# Altium schematic sheet Amplifiers1.SchDoc
size A4; SheetNumber: 5; SheetTotal: 7
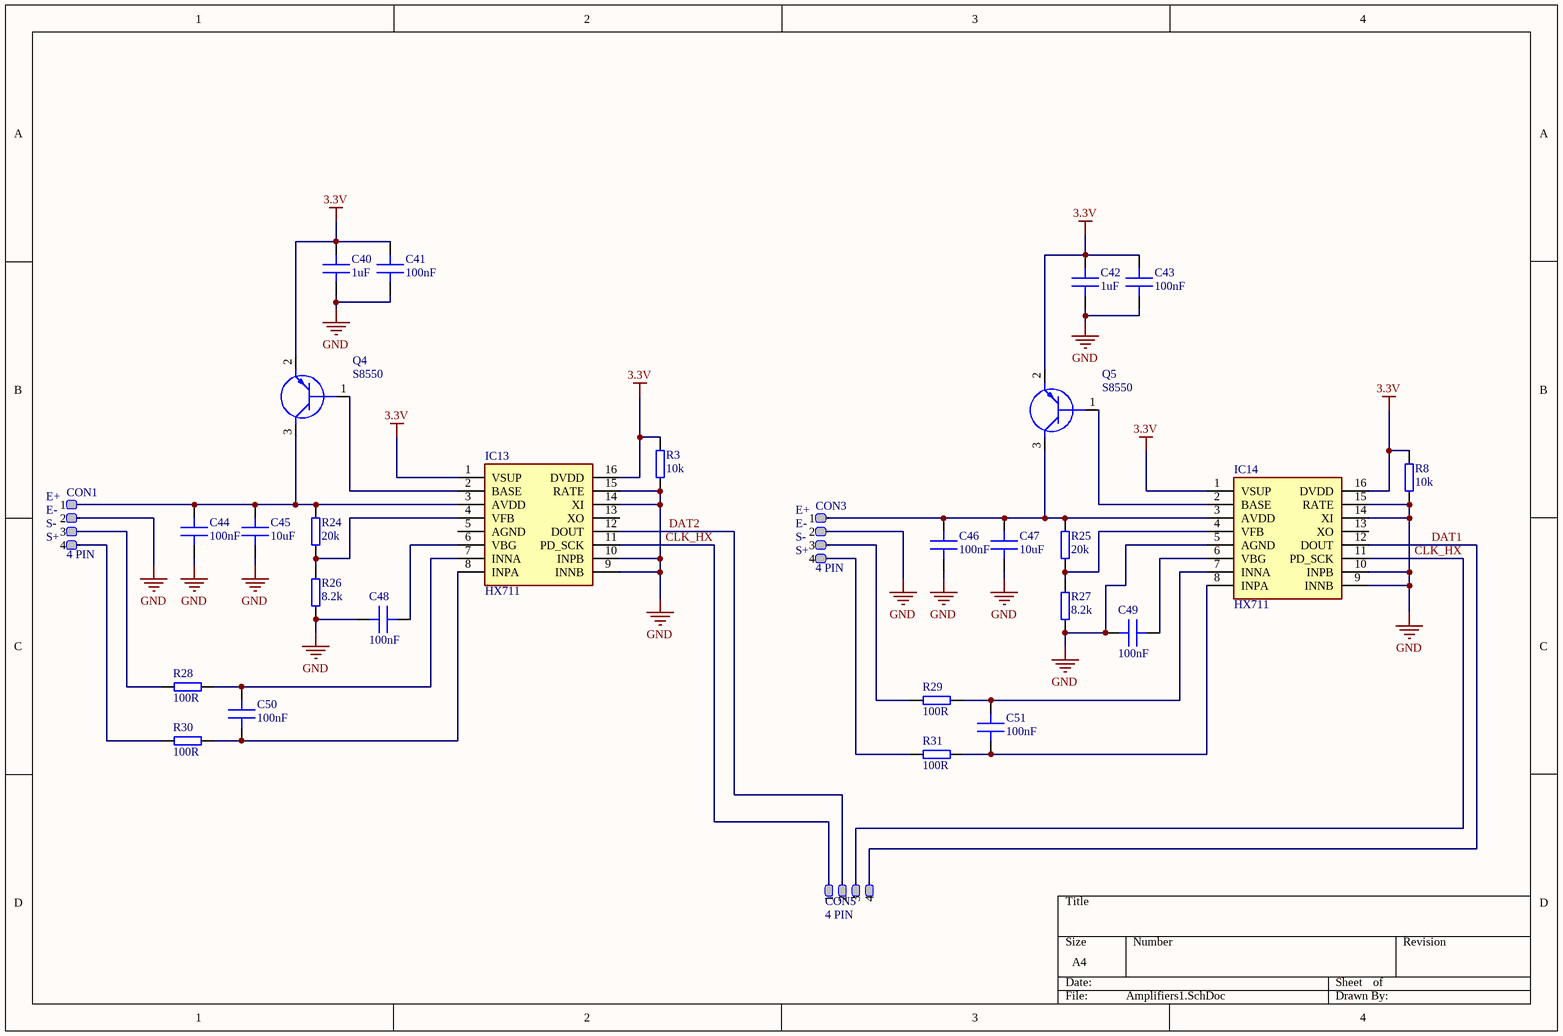
[diagram p0: Amplifiers1.SchDoc]

## Parts
C40  1uF  [C 0402]
C41  100nF  [C 0402]
C42  1uF  [C 0402]
C43  100nF  [C 0402]
C44  100nF  [C 0402]
C45  10uF  [C 0402]
C46  100nF  [C 0402]
C47  10uF  [C 0402]
C48  100nF  [C 0402]
C49  100nF  [C 0402]
C50  100nF  [C 0402]
C51  100nF  [C 0402]
CON1  4 PIN  [BM04B-SRSS-TB]
CON3  4 PIN  [BM04B-SRSS-TB]
CON5  4 PIN  [Goldpin 1.27mm 4PIN]
IC13  HX711  [SOIC127P600X160-16N]
IC14  HX711  [SOIC127P600X160-16N]
Q4  S8550  [SOT95P240X110-3N]
Q5  S8550  [SOT95P240X110-3N]
R3  10k  [R 0402]
R8  10k  [R 0402]
R24  20k  [R 0402]
R25  20k  [R 0402]
R26  8.2k  [R 0402]
R27  8.2k  [R 0402]
R28  100R  [R 0402]
R29  100R  [R 0402]
R30  100R  [R 0402]
R31  100R  [R 0402]

## Nets
3.3V: C40.1 C41.1 C42.1 C43.1 IC13.1(VSUP) IC13.16(DVDD) IC14.1(VSUP) IC14.16(DVDD) Q4.2(E) Q5.2(E) R3.2 R8.2
GND: C40.2 C41.2 C42.2 C43.2 C44.2 C45.2 C46.2 C47.2 C48.1 C49.1 CON1.2 CON3.2 IC13.9(INNB) IC13.10(INPB) IC13.14(XI) IC13.15(RATE) IC14.5(AGND) IC14.9(INNB) IC14.10(INPB) IC14.14(XI) IC14.15(RATE) R3.1 R8.1 R26.1 R27.1
CLK_HX: CON5.1 CON5.3 IC13.11(PD_SCK) IC14.11(PD_SCK)
DAT1: CON5.4 IC14.12(DOUT)
DAT2: CON5.2 IC13.12(DOUT)
NetC44_1: C44.1 C45.1 CON1.1 IC13.3(AVDD) Q4.3(C) R24.2
NetC46_1: C46.1 C47.1 CON3.1 IC14.3(AVDD) Q5.3(C) R25.2
NetC48_2: C48.2 IC13.6(VBG)
NetC49_2: C49.2 IC14.6(VBG)
NetC50_1: C50.1 IC13.8(INPA) R30.1
NetC50_2: C50.2 IC13.7(INNA) R28.1
NetC51_1: C51.1 IC14.8(INPA) R31.1
NetC51_2: C51.2 IC14.7(INNA) R29.1
NetCON1_3: CON1.3 R28.2
NetCON1_4: CON1.4 R30.2
NetCON3_3: CON3.3 R29.2
NetCON3_4: CON3.4 R31.2
NetIC13_2: IC13.2(BASE) Q4.1(B)
NetIC13_4: IC13.4(VFB) R24.1 R26.2
NetIC14_2: IC14.2(BASE) Q5.1(B)
NetIC14_4: IC14.4(VFB) R25.1 R27.2

Not connected (* = marked no-connect by the designer): IC13 5(AGND) 13(XO); IC14 13(XO)

## Notes on the sheet
- (near CON1) E+
- (near CON1) E-
- (near CON3) E+
- (near CON1) S-
- (near CON1) S+
- (near CON3) E-
- (near CON3) S-
- (near CON3) S+

## Library data of the parts
C40-C51 = Capacitor: MLCC Capacitor
IC13 IC14 = HX711: Integrated Circuit; Manufacturer_Name: AVIA; Datasheet Link: https://cdn.sparkfun.com/datasheets/Sensors/ForceFlex/hx711_english.pdf; Height: 1.6mm; Manufacturer_Part_Number: HX711
Q4 Q5 = S8550: Transistor BJT PNP; Manufacturer_Name: Galaxy; Datasheet Link: https://datasheet.datasheetarchive.com/originals/distributors/Datasheets-3/DSA-49109.pdf; Height: 1.1mm; Manufacturer_Part_Number: S8550
R3 R8 R24-R31 = Resistor: General pourpouse resistor